# Altium project FPGA_Frontpanel_2_V2.PrjPcb
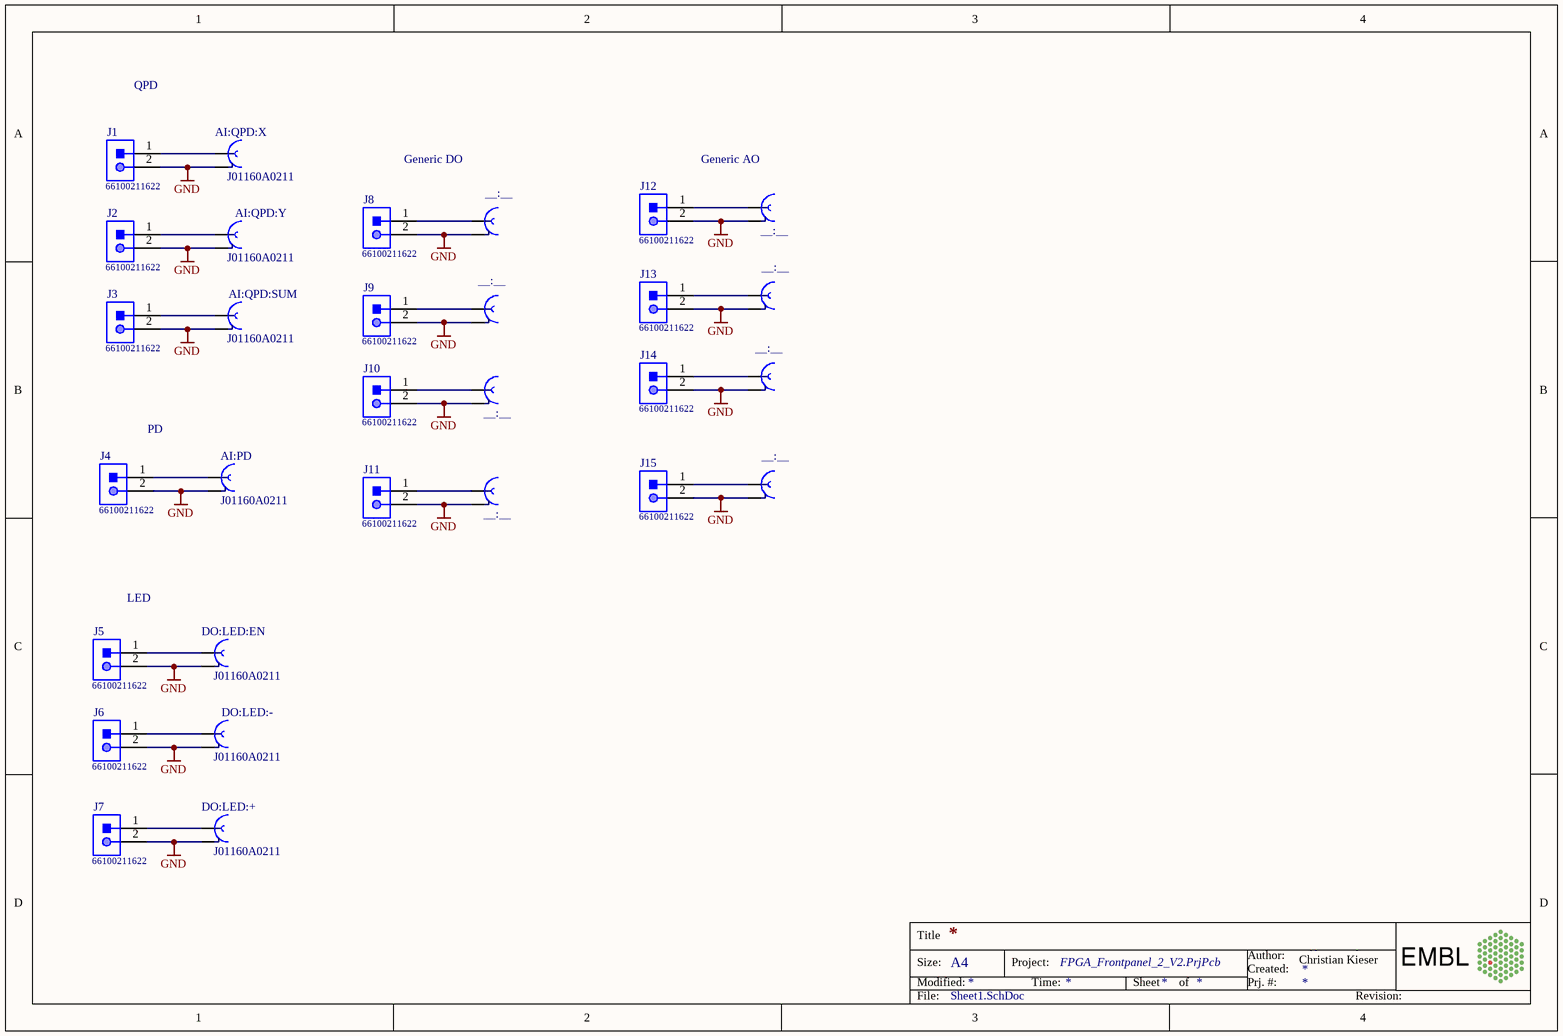
[diagram p0: Sheet1.SchDoc]
1 sheet, 30 parts. Net scope: global (net labels, ports and power ports of the same name join across sheets).
Board file: board2.PcbDoc

## Sheet Sheet1.SchDoc
size A4; Author: Christian Kieser; Engineer: Christian Kieser

### Parts
AI:PD  J01160A0211  [J01160A0211]
AI:QPD:SUM  J01160A0211  [J01160A0211]
AI:QPD:X  J01160A0211  [J01160A0211]
AI:QPD:Y  J01160A0211  [J01160A0211]
DO:LED:+  J01160A0211  [J01160A0211]
DO:LED:-  J01160A0211  [J01160A0211]
DO:LED:EN  J01160A0211  [J01160A0211]
J1  66100211622  [66100211622]
J2  66100211622  [66100211622]
J3  66100211622  [66100211622]
J4  66100211622  [66100211622]
J5  66100211622  [66100211622]
J6  66100211622  [66100211622]
J7  66100211622  [66100211622]
J8  66100211622  [66100211622]
J8_1  __:__  [J01160A0211]
J9  66100211622  [66100211622]
J9_1  __:__  [J01160A0211]
J10  66100211622  [66100211622]
J10_1  __:__  [J01160A0211]
J11  66100211622  [66100211622]
J11_1  __:__  [J01160A0211]
J12  66100211622  [66100211622]
J12_1  __:__  [J01160A0211]
J13  66100211622  [66100211622]
J13_1  __:__  [J01160A0211]
J14  66100211622  [66100211622]
J14_1  __:__  [J01160A0211]
J15  66100211622  [66100211622]
J15_1  __:__  [J01160A0211]

### Nets
GND: AI:PD.2 AI:QPD:SUM.2 AI:QPD:X.2 AI:QPD:Y.2 DO:LED:+.2 DO:LED:-.2 DO:LED:EN.2 J1.2 J2.2 J3.2 J4.2 J5.2 J6.2 J7.2 J8.2 J8_1.2 J9.2 J9_1.2 J10.2 J10_1.2 J11.2 J11_1.2 J12.2 J12_1.2 J13.2 J13_1.2 J14.2 J14_1.2 J15.2 J15_1.2
NetAI:PD_1: AI:PD.1 J4.1
NetAI:QPD:SUM_1: AI:QPD:SUM.1 J3.1
NetAI:QPD:X_1: AI:QPD:X.1 J1.1
NetAI:QPD:Y_1: AI:QPD:Y.1 J2.1
NetDO:LED:+_1: DO:LED:+.1 J7.1
NetDO:LED:-_1: DO:LED:-.1 J6.1
NetDO:LED:EN_1: DO:LED:EN.1 J5.1
NetJ8_1: J8.1 J8_1.1
NetJ9_1: J9.1 J9_1.1
NetJ10_1: J10.1 J10_1.1
NetJ11_1: J11.1 J11_1.1
NetJ12_1: J12.1 J12_1.1
NetJ13_1: J13.1 J13_1.1
NetJ14_1: J14.1 J14_1.1
NetJ15_1: J15.1 J15_1.1

### Notes on the sheet
- QPD
- Generic DO
- Generic AO
- (near J4) PD
- (near J5) LED
- Christian Kieser
- Title
- Size:
- Modified:
- A4
- Project:
- Time:
- Sheet
- of
- Created:
- Author:
- Prj. #:
- Alfons Riedinger
- File:
- Revision:

### Library data of the parts
AI:PD AI:QPD:SUM AI:QPD:X AI:QPD:Y DO:LED:+ DO:LED:- DO:LED:EN J8_1 J9_1 J10_1 J11_1 J12_1 J13_1 J14_1 J15_1 = CMP-00545-1: RF SMB Connector, Male, Board Mount, Solder Terminal, Receptacle; Panel Mount: No; DIN Conformance: No; VSWR: 1.35; IEC Conformance: Yes; Coupling Type: Snap; Option: General Purpose; Operating Frequency-Max: 4kHz; Characteristic Impedance: 50R; Contact Finish - Mating: COPPER NICKEL GOLD; Contact Finish - Termination: GOLD; Body/Shell Style: RECEPTACLE; JESD-609 Code: e4; MIL Conformance: No; Connector Type: SMB; Insulation Material: POLYTETRAFLUORO; Filter Feature: No; RoHS Compliant: No; Contact Gender: Male; REACH SVHC: Yes; Termination: Solder; Mount: Board; Mounting Style: STRAIGHT
J1-J15 = CMP-001-0161-A.3: WR-WTB 2.54 mm Male Vertical Shrouded Header 2 Pins; Manufacturer: Wurth Electronics; Supplier Part Number: 732-14102-ND; PartNumber: 66100211622; Supplier: Digi-Key